# EAGLE design MegaShield-Teensy356-Carrier-v1.0 (EAGLE 8.3.1)
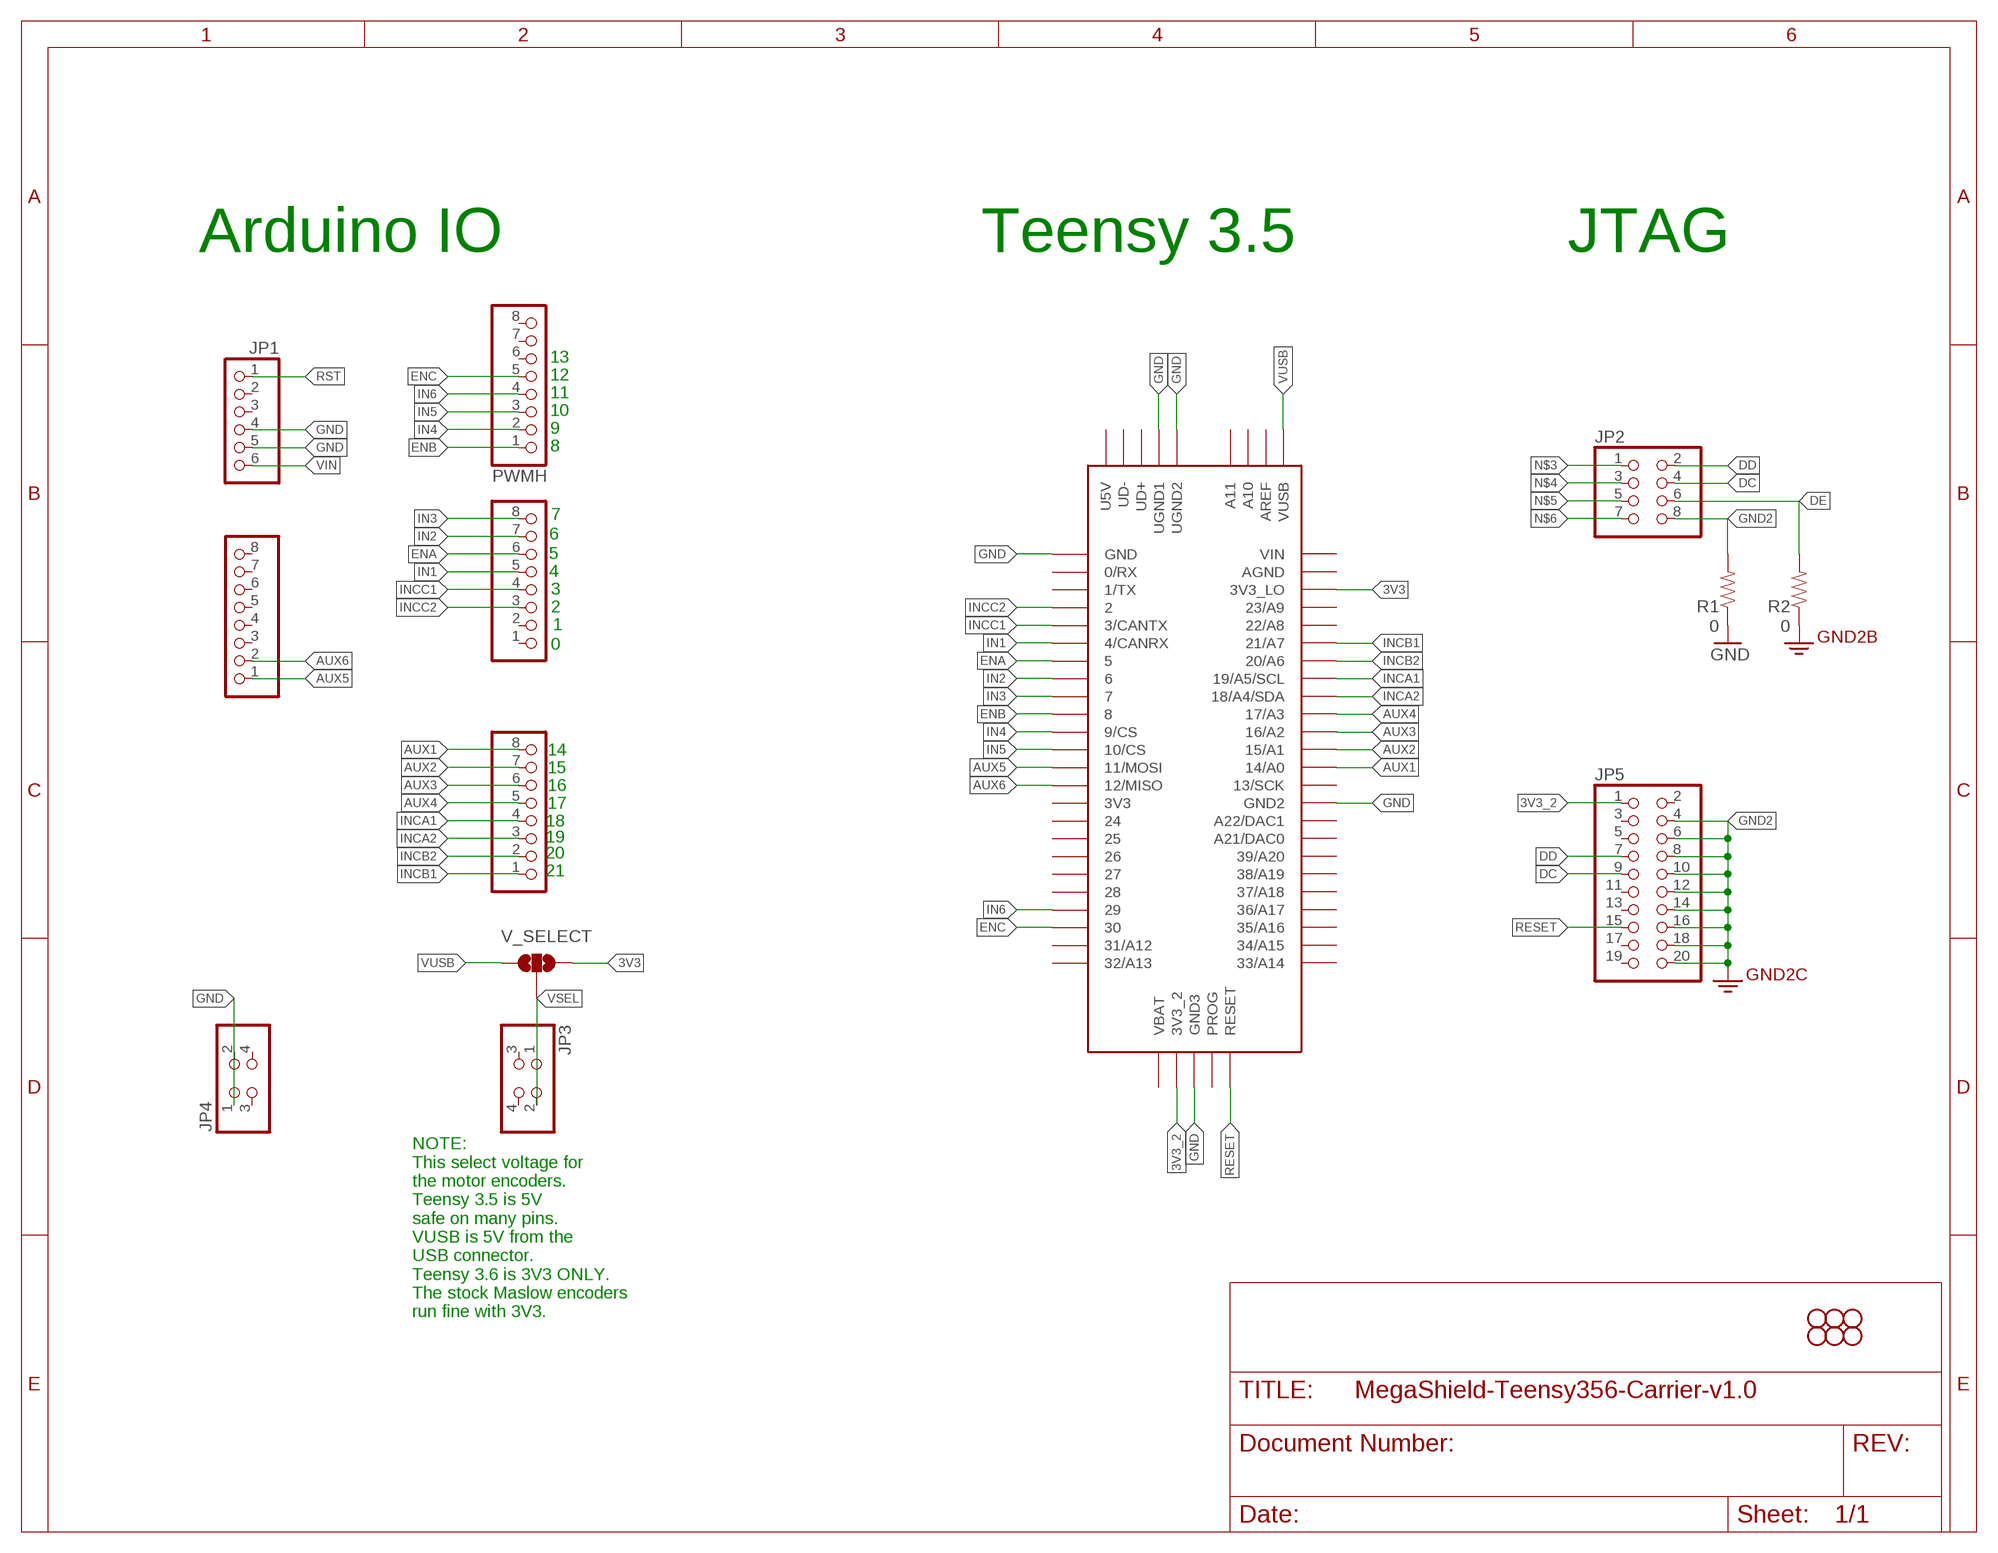
[diagram p0: schematic, sheet 1]

## Parts
COMMUNICATION  PINHD-1X8  [1X08]
COMMUNICATION1  PINHD-1X8  [1X08]
H1  STAND-OFF  [STAND-OFF]
H2  STAND-OFF  [STAND-OFF]
H3  STAND-OFF  [STAND-OFF]
H4  STAND-OFF  [STAND-OFF]
H5  STAND-OFF  [STAND-OFF]
H6  STAND-OFF  [STAND-OFF]
JP1  PINHD-1X6  [1X06]
JP2  PINHD-2X4  [2X04]
JP3  PINHD-2X2  [2X02]
JP4  PINHD-2X2  [2X02]
JP5  PINHD-2X10  [2X10]
PWMH  PINHD-1X8  [1X08]
PWML  PINHD-1X8  [1X08]
R1  0  0OHM-1/10W-5%(0603)  [0603]
R2  0  0OHM-1/10W-5%(0603)  [0603]
U$15  TEENSY_3.5/3.6  [TEENSY_3.5/3.6]
V_SELECT  SOLDERJUMPER_2WAYT  [SJ_2]

## Nets
3V3: U$15.3V3_LO V_SELECT.3
3V3_2: JP5.1 U$15.3V3_2
AUX1: COMMUNICATION.8 U$15.14/A0
AUX2: COMMUNICATION.7 U$15.15/A1
AUX3: COMMUNICATION.6 U$15.16/A2
AUX4: COMMUNICATION.5 U$15.17/A3
AUX5: COMMUNICATION1.1 U$15.11/MOSI
AUX6: COMMUNICATION1.2 U$15.12/MISO
DC: JP2.4 JP5.9
DD: JP2.2 JP5.7
DE: JP2.6 R2.2
ENA: PWML.6 U$15.5
ENB: PWMH.1 U$15.8
ENC: PWMH.5 U$15.30
GND [gnd]: JP1.4 JP1.5 JP4.1 JP4.2 R1.1 U$15.GND U$15.GND2 U$15.GND3 U$15.UGND1 U$15.UGND2
GND2: JP2.8 JP5.4 JP5.6 JP5.8 JP5.10 JP5.12 JP5.14 JP5.16 JP5.18 JP5.20 R1.2 R2.1
IN1: PWML.5 U$15.4/CANRX
IN2: PWML.7 U$15.6
IN3: PWML.8 U$15.7
IN4: PWMH.2 U$15.9/CS
IN5: PWMH.3 U$15.10/CS
IN6: PWMH.4 U$15.29
INCA1: COMMUNICATION.4 U$15.19/A5/SCL
INCA2: COMMUNICATION.3 U$15.18/A4/SDA
INCB1: COMMUNICATION.1 U$15.21/A7
INCB2: COMMUNICATION.2 U$15.20/A6
INCC1: PWML.4 U$15.3/CANTX
INCC2: PWML.3 U$15.2
N$3: JP2.1
N$4: JP2.3
N$5: JP2.5
N$6: JP2.7
RESET: JP5.15 U$15.RESET
RST: JP1.1
VIN: JP1.6
VSEL: JP3.1 JP3.2 V_SELECT.2
VUSB: U$15.VUSB V_SELECT.1
Unconnected: COMMUNICATION1.3 COMMUNICATION1.4 COMMUNICATION1.5 COMMUNICATION1.6 COMMUNICATION1.7 COMMUNICATION1.8 JP1.2 JP1.3 JP3.3 JP3.4 JP4.3 JP4.4 JP5.2 JP5.3 JP5.5 JP5.11 JP5.13 JP5.17 JP5.19 PWMH.6 PWMH.7 PWMH.8 PWML.1 PWML.2 U$15.0/RX U$15.1/TX U$15.3V3 U$15.13/SCK U$15.21/DAC0(A21/DAC0) U$15.22/A8 U$15.23/A9 U$15.24 U$15.25 U$15.26 U$15.27 U$15.28 U$15.31/A12 U$15.32/A13 U$15.33/A14 U$15.34/A15 U$15.35/A16 U$15.36/A17 U$15.37/A18 U$15.38/A19 U$15.39/A20 U$15.A10 U$15.A11 U$15.A22/DAC1 U$15.AGND U$15.AREF U$15.PROG U$15.U5V U$15.UD+ U$15.UD- U$15.VBAT U$15.VIN

## Notes on the sheet
- Arduino IO | Teensy 3.5 | JTAG
- 13
- 12
- 11
- 10
- 9
- 8
- 7
- 6
- 5
- 4
- 3
- 2
- 1
- 0
- 14
- 15
- 16
- 17
- 18
- 19
- 20
- 21
- NOTE: 
  This select voltage for 
  the motor encoders.
  Teensy 3.5 is 5V 
  safe on many pins.
  VUSB is 5V from the 
  USB connector.
  Teensy 3.6 is 3V3 ONLY.
  The stock Maslow encoders
  run fine with 3V3.

## Library data of the parts
COMMUNICATION COMMUNICATION1 PWMH PWML = pinhead:PINHD-1X8: PIN HEADER
H1-H6 = SparkFun-Hardware:STAND-OFF: Stand Off Drill holes for mechanically mounting via screws, standoffs, etc. Note: Use the keepout ring to avoid running the screw head into surrounding components. Variant Overviews STAND-OFF - Mechanical footprint for a #4 phillips button head screw. STAND-OFF-TIGHT - Mechanical footprint for a #4 phillips button head screw, Example SparkFun Products Screw - Phillips Head (1/4", 4-40, 10 pack) <https://www.sparkfun.com/products/10453> (PRT-10453) Screw - Phillips Head (1/2", 4-40, 10 pack) <https://www.sparkfun.com/products/10452> (PRT-10452) Screw - Phillips Head (3/4", 4-40, 10 pack) <https://www.sparkfun.com/products/10451> (PRT-10451) Screw - Phillips Head (1", 4-40, 10 pack) <https://www.sparkfun.com/products/10450> (PRT-10450)
JP1 = pinhead:PINHD-1X6: PIN HEADER
JP2 = adafruit2:PINHD-2X4: PIN HEADER
JP3 JP4 = pinhead:PINHD-2X2: PIN HEADER
JP5 = pinhead:PINHD-2X10: PIN HEADER
R1 R2 = SparkFun-Resistors:0OHM-1/10W-5%(0603): RES-08609; PROD_ID: RES-08609
U$15 = Teensy356:TEENSY_3.5/3.6
V_SELECT = SparkFun:SOLDERJUMPER_2WAY: Solder Jumper 2 way solder jumper

## Net classes
1 power: width 0.61 mm, drill 0.711 mm, clearance 0.203 mm
2 gnd: width 0.305 mm, drill 0.711 mm, clearance 0.203 mm
3 usbvcc: width 0.508 mm, drill 0.711 mm, clearance 0.203 mm

## Board
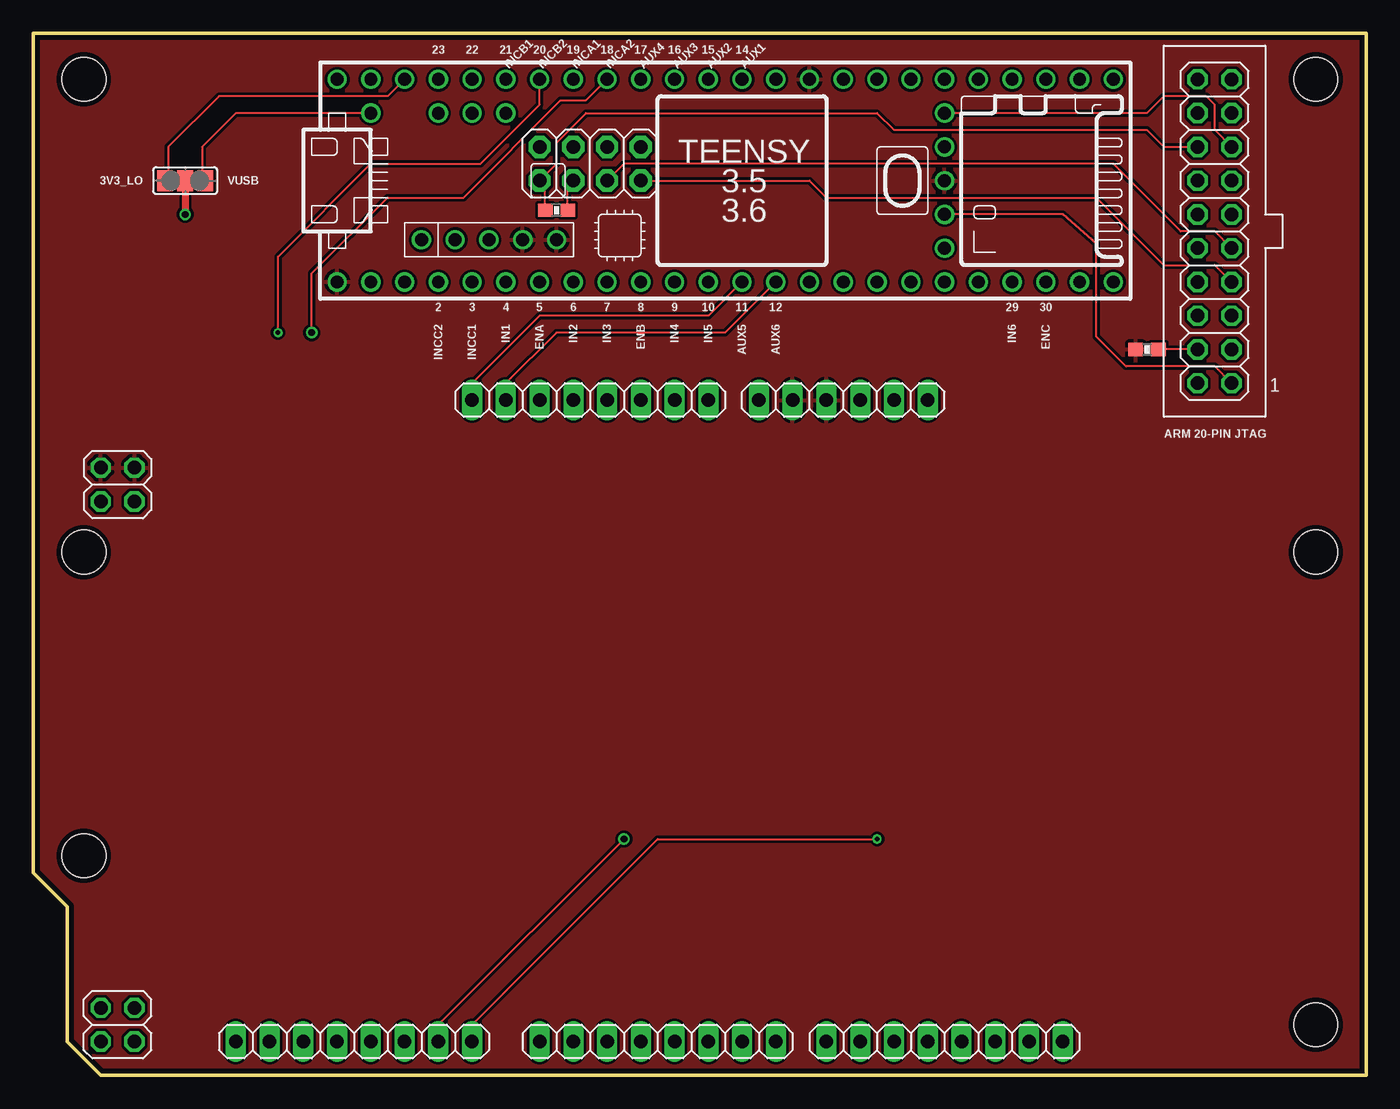
[diagram p1: board, top side]
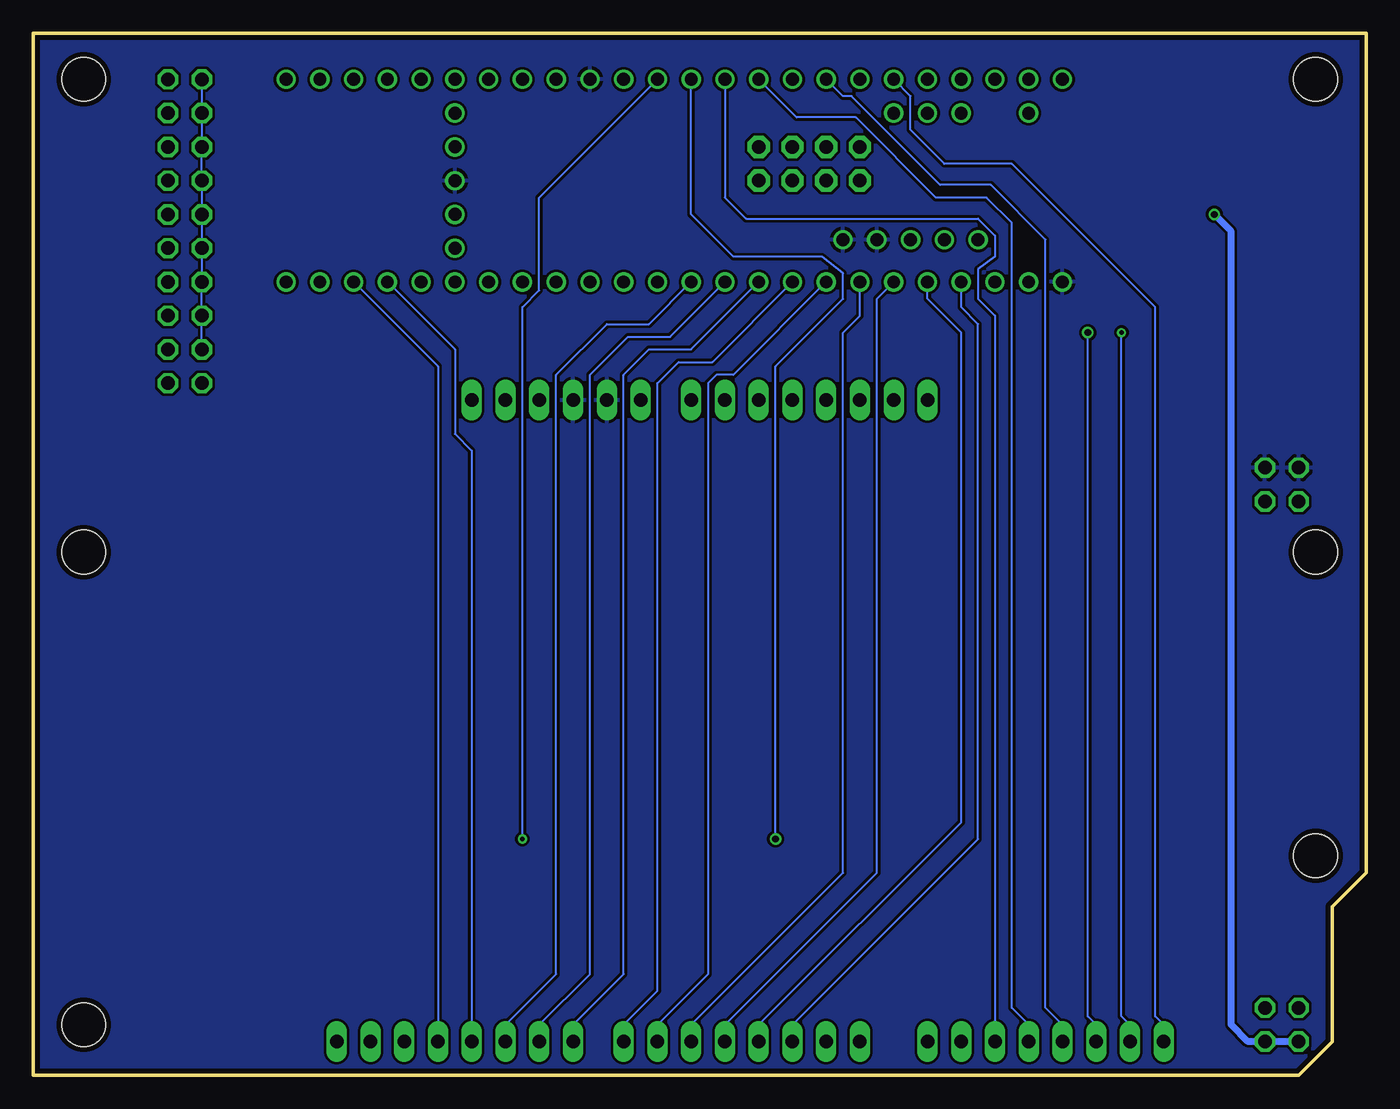
[diagram p2: board, bottom side, seen from below]

Size 100.32 x 78.4 mm. Coordinates in mm from the lower left corner, seen from the top.
Outline: 5.09,0 2.55,2.54 2.55,12.7 0.01,15.24 0.01,50.62 0,52.99 0.01,78.4 100.32,78.4 100.32,0 5.09,0
Copper layers (1*16): Top 0.0356mm / dielectric 1.5011mm / Bottom 0.0356mm
Design rules "PCBs_io *": minimum track width 6mil, minimum drill 13mil, track to track 6mil, track to pad 6mil, pad to pad 6mil, via to via 6mil, smd to smd 6mil, copper to edge 15mil, drill to drill 6mil, minimum pad ring 7mil, minimum via ring 7mil, stop-mask expansion 3mil, vias tented up to drill 0mil, thermal gap 10mil

### Footprints (pad centres in the part's own frame; a part is rotated, then mirrored left to right if it is on the bottom)
1X08 = drill 1.016 long: 1 -8.89,0; 2 -6.35,0; 3 -3.81,0; 4 -1.27,0; 5 1.27,0; 6 3.81,0; 7 6.35,0; 8 8.89,0
STAND-OFF = hole 3.302: 0,0
1X06 = drill 1.016 long: 1 -6.35,0; 2 -3.81,0; 3 -1.27,0; 4 1.27,0; 5 3.81,0; 6 6.35,0
2X04 = drill 1.016 pad 1.676 octagon: 1 -3.81,-1.27; 2 -3.81,1.27; 3 -1.27,-1.27; 4 -1.27,1.27; 5 1.27,-1.27; 6 1.27,1.27; 7 3.81,-1.27; 8 3.81,1.27
2X02 = drill 1.016 octagon: 1 -1.27,-1.27; 2 -1.27,1.27; 3 1.27,-1.27; 4 1.27,1.27
2X10 = drill 1.016 octagon: 1 -11.43,-1.27; 2 -11.43,1.27; 3 -8.89,-1.27; 4 -8.89,1.27; 5 -6.35,-1.27; 6 -6.35,1.27; 7 -3.81,-1.27; 8 -3.81,1.27; 9 -1.27,-1.27; 10 -1.27,1.27; 11 1.27,-1.27; 12 1.27,1.27; 13 3.81,-1.27; 14 3.81,1.27; 15 6.35,-1.27; 16 6.35,1.27; 17 8.89,-1.27; 18 8.89,1.27; 19 11.43,-1.27; 20 11.43,1.27
0603 = smd 1.1 x 1: 1 -0.85,0; 2 0.85,0
TEENSY_3.5/3.6 = drill 0.965: 0/RX -25.4,-7.62; 1/TX -22.86,-7.62; 2 -20.32,-7.62; 3/CANTX -17.78,-7.62; 3V3 7.62,-7.62; 3V3_2 17.78,-2.54; 3V3_LO -22.86,7.62; 4/CANRX -15.24,-7.62; 5 -12.7,-7.62; 6 -10.16,-7.62; 7 -7.62,-7.62; 8 -5.08,-7.62; 9/CS -2.54,-7.62; 10/CS 0,-7.62; 11/MOSI 2.54,-7.62; 12/MISO 5.08,-7.62; 13/SCK 5.08,7.62; 14/A0 2.54,7.62; 15/A1 0,7.62; 16/A2 -2.54,7.62; 17/A3 -5.08,7.62; 18/A4/SDA -7.62,7.62; 19/A5/SCL -10.16,7.62; 20/A6 -12.7,7.62; 21/A7 -15.24,7.62; 21/DAC0 12.7,7.62; 22/A8 -17.78,7.62; 23/A9 -20.32,7.62; 24 10.16,-7.62; 25 12.7,-7.62; 26 15.24,-7.62; 27 17.78,-7.62; 28 20.32,-7.62; 29 22.86,-7.62; 30 25.4,-7.62; 31/A12 27.94,-7.62; 32/A13 30.48,-7.62; 33/A14 30.48,7.62; 34/A15 27.94,7.62; 35/A16 25.4,7.62; 36/A17 22.86,7.62; 37/A18 20.32,7.62; 38/A19 17.78,7.62; 39/A20 15.24,7.62; A10 -17.78,5.08; A11 -15.24,5.08; A22/DAC1 10.16,7.62; AGND -25.4,7.62; AREF -20.32,5.08; GND -27.94,-7.62; GND2 7.62,7.62; GND3 17.78,0; PROG 17.78,2.54; RESET 17.78,5.08; U5V -21.59,-4.445; UD+ -16.51,-4.445; UD- -19.05,-4.445; UGND1 -13.97,-4.445; UGND2 -11.43,-4.445; VBAT 17.78,-5.08; VIN -27.94,7.62; VUSB -25.4,5.08
SJ_2 = smd 1.168 x 1.6: 1 -1.524,0; 2 0,0; 3 1.524,0

### Placement (x,y rotation side)
COMMUNICATION  24.14,2.54 0 top
COMMUNICATION1  41.92,50.8 0 top
H1  3.82,39.37 0 top
H2  96.53,74.93 0 top
H3  96.53,39.37 0 top
H4  3.82,74.93 0 top
H5  96.53,3.81 0 top
H6  3.82,16.51 0 top
JP1  60.97,50.8 180 top
JP2  41.92,68.58 180 top
JP3  6.36,3.81 90 top
JP4  6.36,44.45 270 top
JP5  88.91,63.5 90 top
PWMH  68.59,2.54 0 top
PWML  47,2.54 0 top
R1  83.83,54.61 0 top
R2  39.38,65.09 0 top
U$15  50.81,67.31 0 top
V_SELECT  11.44,67.31 180 top

### Tracks (layer width: path | path; a pad name or v marks a point on that pad's centre or on a via)
3V3
  Top 0.152: U$15.3V3_LO 26.68,73.66 13.98,73.66 10.17,69.85 10.17,67.56 V_SELECT.3
3V3_2
  Top 0.152: JP5.1 88.91,53.34 82.24,53.34 80.02,55.56 80.02,62.55 77.48,64.77 U$15.3V3_2
AUX1  (via drill 0.33)
  Top 0.152: v63.51,17.78 47,17.78 33.03,3.81 COMMUNICATION.8
  Bottom 0.152: U$15.14/A0 62.24,66.04 62.24,59.05 63.51,57.78 v63.51,17.78
AUX2  (via drill 0.51)
  Top 0.152: v44.46,17.78 30.49,3.81 COMMUNICATION.7
  Bottom 0.152: v44.46,17.78 44.46,53.34 39.38,58.42 39.38,60.33 40.97,61.59 47.63,61.59 50.81,64.77 U$15.15/A1
AUX3
  Bottom 0.152: COMMUNICATION.6 27.95,57.15 29.22,58.42 29.22,60.64 27.95,61.59 27.95,63.18 29.22,64.45 46.68,64.45 48.27,66.04 U$15.16/A2
AUX4
  Bottom 0.152: U$15.17/A3 42.87,72.07 38.42,72.07 32.39,66.04 28.58,66.04 26.68,64.14 26.68,5.08 25.41,3.81 COMMUNICATION.5
AUX5
  Top 0.152: U$15.11/MOSI 50.81,57.15 38.11,57.15 33.03,52.07 COMMUNICATION1.1
AUX6
  Top 0.152: U$15.12/MISO 52.08,55.88 39.38,55.88 35.57,52.07 COMMUNICATION1.2
DC
  Top 0.152: JP5.9 88.91,63.5 86.37,63.5 81.29,68.58 44.46,68.58 JP2.4
DD
  Top 0.152: JP2.2 58.43,67.31 59.7,66.04 80.02,66.04 85.1,60.96 88.91,60.96 JP5.7
DE
  Top 0.152: R2.2 40.23,66.89 JP2.6
ENA
  Bottom 0.152: U$15.5 38.11,57.15 39.38,55.88 39.38,15.24 50.81,3.81 PWML.6
ENB
  Bottom 0.152: U$15.8 50.81,54.61 53.98,54.61 55.89,52.7 55.89,7.62 59.7,3.81 PWMH.1
ENC
  Bottom 0.152: U$15.30 69.86,53.34 PWMH.5
GND
  pour Bottom: 0.01,78.42 0.01,15.24 2.55,12.7 2.55,2.54 5.09,0 100.34,0 100.34,78.42
  pour Top: 0.01,78.42 0.01,15.24 2.55,12.7 2.55,2.54 5.09,0 100.34,0 100.34,78.42
GND2
  Top 0.152: 38.13,67.33 39.38,68.58 39.38,70.17 41.6,72.39 63.51,72.39 64.78,71.12 83.83,71.12 85.1,69.85 JP5.16 | 38.13,67.33 JP2.8 | JP5.4 R1.2 | R2.1 38.53,66.94 38.13,67.33
  Bottom 0.152: JP5.20 JP5.18 JP5.16 JP5.14 JP5.12 JP5.10 JP5.8 JP5.6 JP5.4
IN1
  Bottom 0.152: U$15.4/CANRX 36.84,58.42 36.84,15.24 48.27,3.81 PWML.5
IN2
  Bottom 0.152: U$15.6 47.63,52.7 48.9,52.7 49.54,52.07 49.54,7.62 53.35,3.81 PWML.7
IN3
  Bottom 0.152: U$15.7 49.22,53.66 51.76,53.66 53.35,52.07 53.35,6.35 55.89,3.81 PWML.8
IN4
  Bottom 0.152: U$15.9/CS 52.4,55.56 55.57,55.56 58.43,52.7 58.43,7.62 62.24,3.81 PWMH.2
IN5
  Bottom 0.152: U$15.10/CS 53.98,56.52 57.16,56.52 60.97,52.7 60.97,7.62 64.78,3.81 PWMH.3
IN6
  Bottom 0.152: U$15.29 68.59,54.61 68.59,48.26 67.32,46.99 PWMH.4
INCA1
  Bottom 0.152: U$15.19/A5/SCL 39.38,73.66 38.74,73.66 32.08,66.99 28.27,66.99 24.14,62.87 24.14,5.08 22.87,3.81 COMMUNICATION.4
INCA2  (via drill 0.51)
  Top 0.152: v20.96,55.88 20.96,60.33 26.68,66.04 32.39,66.04 39.7,73.34 41.6,73.34 U$15.18/A4/SDA
  Bottom 0.152: v20.96,55.88 20.96,4.45 20.33,3.81 COMMUNICATION.3
INCB1
  Bottom 0.152: U$15.21/A7 34.3,73.66 34.3,71.12 31.76,68.58 26.68,68.58 15.88,57.78 15.88,4.45 15.25,3.81 COMMUNICATION.1
INCB2  (via drill 0.33)
  Top 0.152: U$15.20/A6 38.11,73.03 33.66,68.58 25.41,68.58 18.42,61.59 v18.42,55.88
  Bottom 0.152: v18.42,55.88 18.42,4.45 17.79,3.81 COMMUNICATION.2
INCC1
  Bottom 0.152: U$15.3/CANTX 33.03,58.42 30.49,55.88 30.49,19.05 45.73,3.81 PWML.4
INCC2
  Bottom 0.152: U$15.2 30.49,57.78 29.22,56.52 29.22,17.78 43.19,3.81 PWML.3
RESET
  Top 0.152: JP5.15 88.91,71.12 88.91,73.03 88.27,73.66 85.1,73.66 83.83,72.39 U$15.RESET
VSEL  (via drill 0.51)
  Top 0.508: v11.44,64.77 V_SELECT.2 10.17,67.31
  Bottom 0.508: v11.44,64.77 10.17,63.5 10.17,3.81 8.9,2.54 JP3.1 JP3.2
VUSB
  Top 0.152: U$15.VUSB 15.25,72.39 12.71,69.85 12.71,67.56 V_SELECT.1

### Text on the board
tPlace: 23 | 22 | 21 | 20 | 19 | 18 | 17 | 16 | 15 | 14 | INCB1 | INCB2 | INCA1 | INCA2 | AUX4 | AUX3 | AUX2 | AUX1 | 3V3_LO | VUSB | 2 | 3 | 4 | 5 | 6 | 7 | 8 | 9 | 10 | 11 | 12 | 29 | 30 | INCC2 | INCC1 | IN1 | ENA | IN2 | IN3 | ENB | IN4 | IN5 | AUX5 | AUX6 | IN6 | ENC | 1 | ARM 20-PIN JTAG
tplace-old: INCB1 | INCB2 | INCA1 | INCA2 | AUX4 | AUX3 | AUX2 | AUX1 | 23 | 22 | 21 | 20 | 19 | 18 | 17 | 16 | 15 | 14 | 2 | 3 | 4 | 5 | 6 | 7 | 8 | 9 | 10 | 29 | 30 | INCC2 | INCC1 | IN1 | ENA | IN2 | IN3 | ENB | IN4 | ENC | IN5 | IN6